# Altium project Motor_driver.PrjPcb
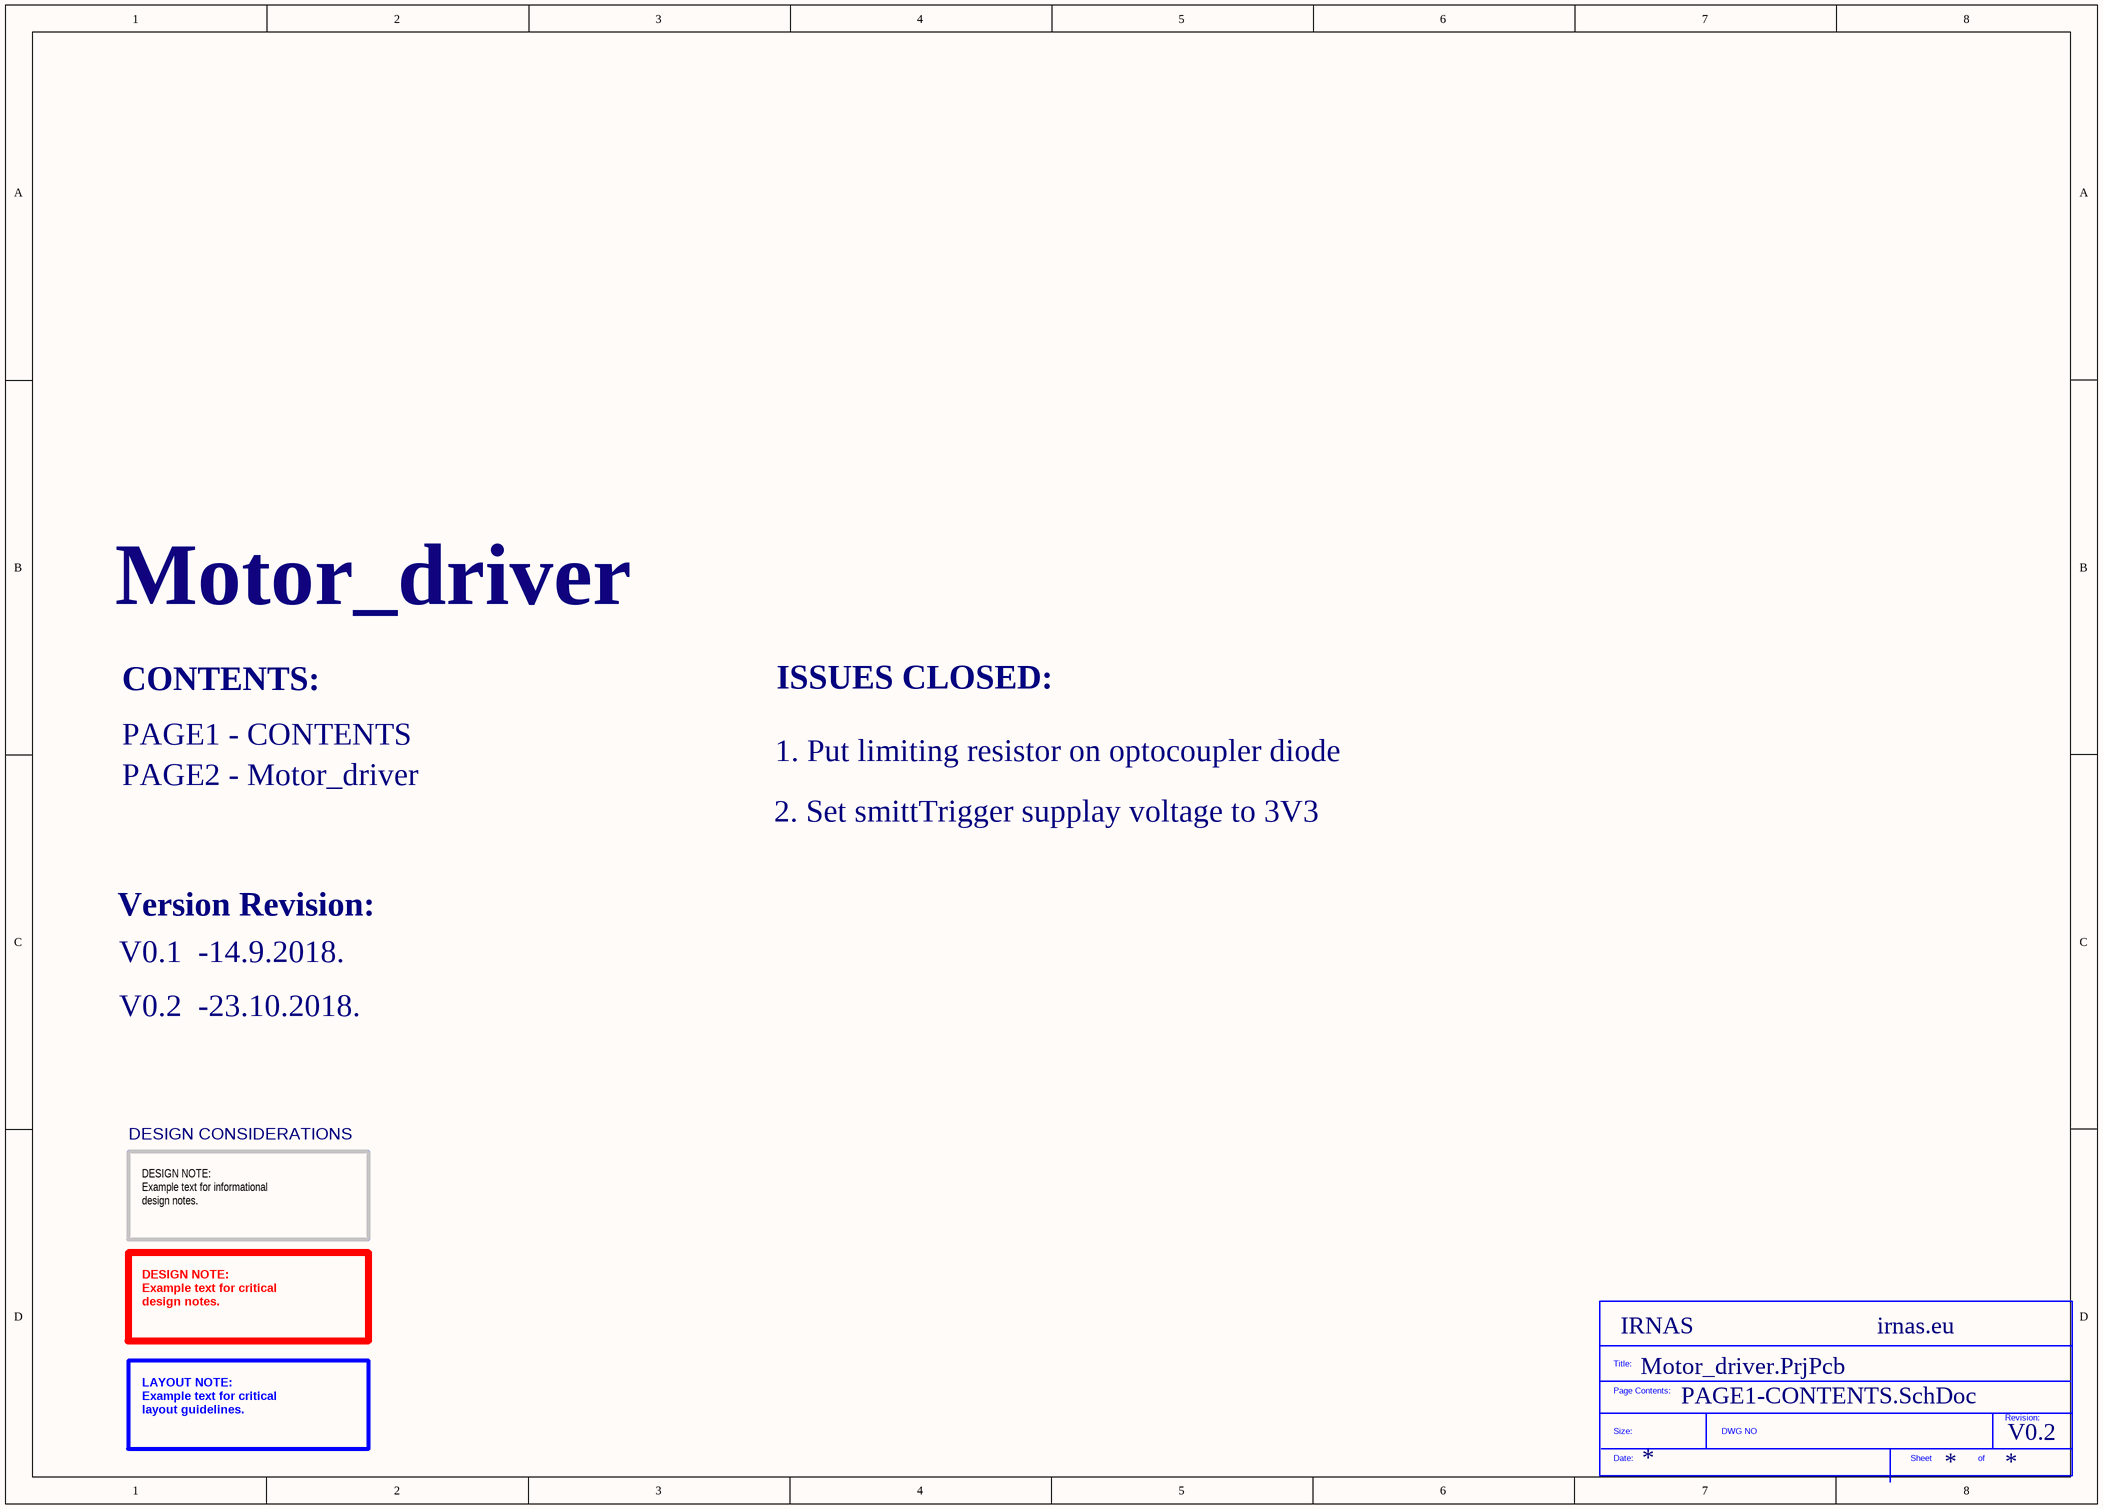
[diagram p0: PAGE1-CONTENTS.SchDoc]
Company: IRNAS; ProjectTitle: Motor_driver; Version: V0.2; website: irnas.eu
2 sheets, 36 parts. Net scope: global (net labels, ports and power ports of the same name join across sheets).
Board file: Motor_driver.PcbDoc
Sheets:
  PAGE1-CONTENTS.SchDoc
  PAGE2-Motor_driver-PCB.SchDoc

## Sheet PAGE1-CONTENTS.SchDoc
size A3

### Parts
(Parts that share a designator on the sheet are numbered #1, #2 ... from top to bottom, then left to right.)
*?#1  SDTitleBlock  (value not drawn)  (graphical)

### Notes on the sheet
- CONTENTS:
- ISSUES CLOSED:
- PAGE1 - CONTENTS
- PAGE2 - Motor_driver
- 1. Put limiting resistor on optocoupler diode
- 2. Set smittTrigger supplay voltage to 3V3
- Version Revision:
- V0.1  -14.9.2018.
- V0.2  -23.10.2018.
- DESIGN CONSIDERATIONS
- DESIGN NOTE:
  Example text for informational
  design notes.
- DESIGN NOTE:
  Example text for critical
  design notes.
- LAYOUT NOTE:
  Example text for critical
  layout guidelines.
- (in symbol SDTitleBlock) Title:; Page Contents:; Revision:; Size:; DWG NO; Date:; Sheet; of

## Sheet PAGE2-Motor_driver-PCB.SchDoc
size A3
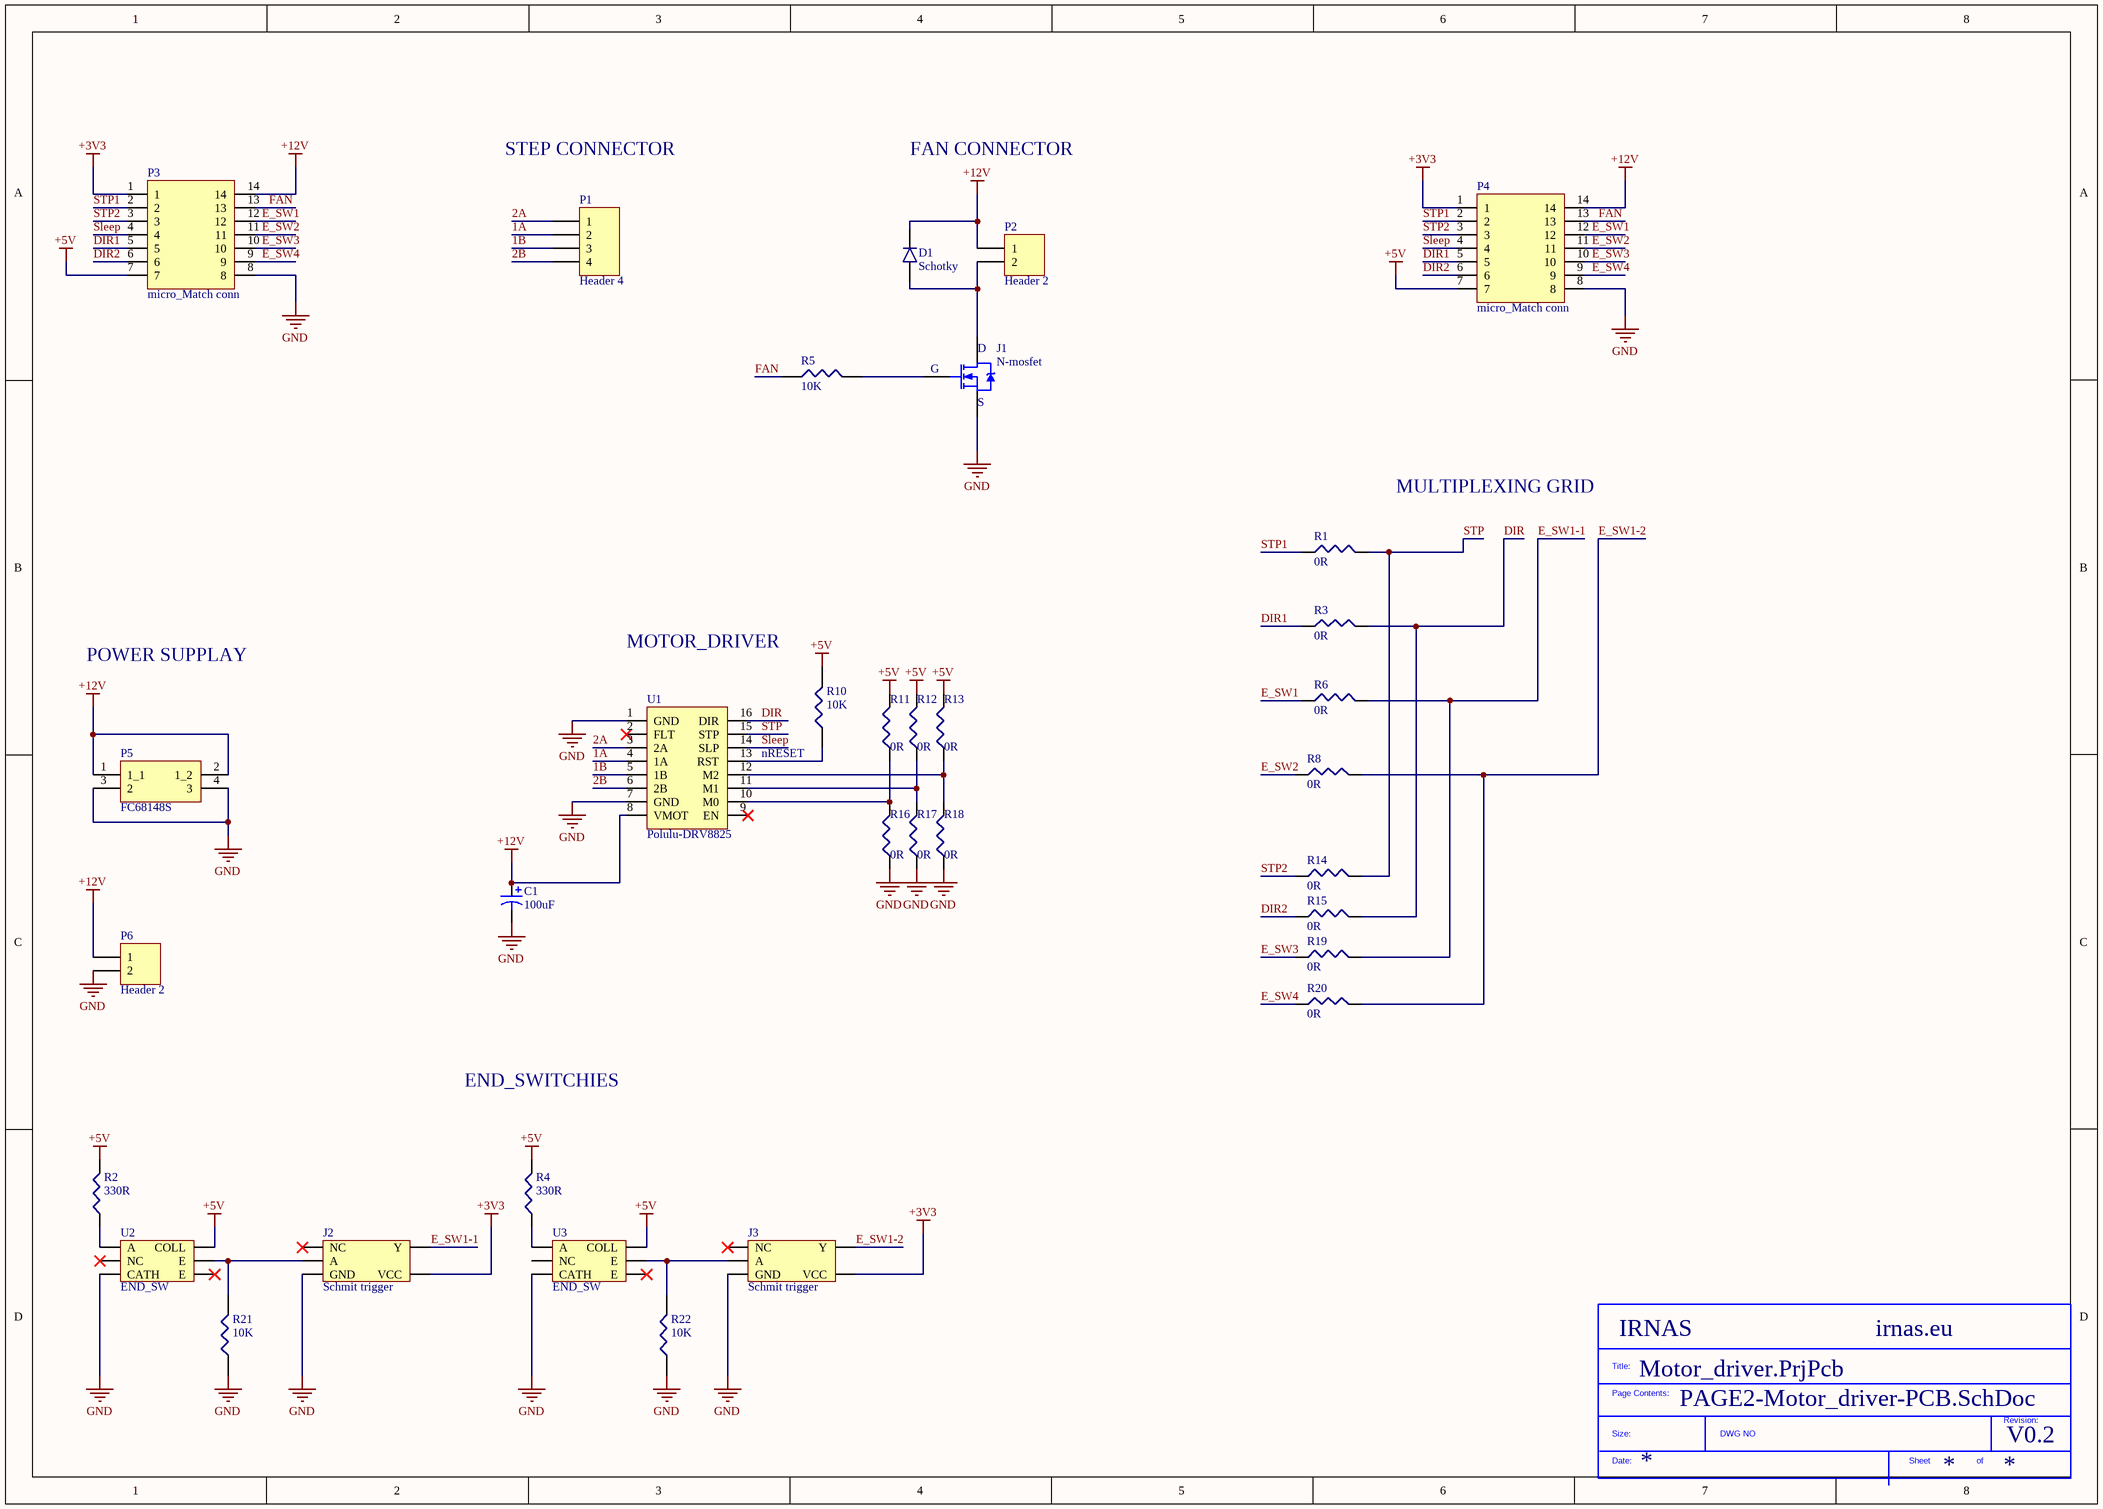
[diagram p1: PAGE2-Motor_driver-PCB.SchDoc]

### Parts
(Parts that share a designator on the sheet are numbered #1, #2 ... from top to bottom, then left to right.)
*?#2  SDTitleBlock  (value not drawn)  (graphical)
C1  100uF  [EEEFK1J470P]
D1  Schotky  [Schotky]
J1  N-mosfet  [SOT_Nmos]
J2  Schmit trigger  [SOT65P212X112-5N]
J3  Schmit trigger  [SOT65P212X112-5N]
P1  Header 4  [HDR1X4]
P2  Header 2  [HDR1X2]
P3  micro_Match conn  [micro_Match]
P4  micro_Match conn  [micro_Match]
P5  FC68148S  [DC power connector]
P6  Header 2  [HDR1X2]
R1  0R  [0603res]
R2  330R  [0603res]
R3  0R  [0603res]
R4  330R  [0603res]
R5  10K  [0603res]
R6  0R  [0603res]
R8  0R  [0603res]
R10  10K  [0603res]
R11  0R  [0603res]
R12  0R  [0603res]
R13  0R  [0603res]
R14  0R  [0603res]
R15  0R  [0603res]
R16  0R  [0603res]
R17  0R  [0603res]
R18  0R  [0603res]
R19  0R  [0603res]
R20  0R  [0603res]
R21  10K  [0603res]
R22  10K  [0603res]
U1  Polulu-DRV8825  [DIP16]
U2  END_SW  [END_switch]
U3  END_SW  [END_switch]

### Nets
+3V3: J2.5(VCC) J3.5(VCC) P3.1 P4.1
+5V: P3.7 P4.7 R2.2 R4.2 R10.2 R11.2 R12.2 R13.2 U2.6(COLL) U3.6(COLL)
+12V: C1.1 D1.2 P2.1 P3.14 P4.14 P5.1(1_1) P5.2(1_2) P6.1 U1.8(VMOT)
GND: C1.2 J1.2(S) J2.3(GND) J3.3(GND) P3.8 P4.8 P5.3(2) P5.4(3) P6.2 R16.1 R17.1 R18.1 R21.1 R22.1 U1.1(GND) U1.7(GND) U2.3(CATH) U3.3(CATH)
1A: P1.2 U1.4(1A)
1B: P1.3 U1.5(1B)
2A: P1.1 U1.3(2A)
2B: P1.4 U1.6(2B)
DIR: R3.2 R15.2 U1.16(DIR)
DIR1: P3.5 P4.5 R3.1
DIR2: P3.6 P4.6 R15.1
E_SW1: P3.12 P4.12 R6.1
E_SW1-1: J2.4(Y) R6.2 R19.2
E_SW1-2: J3.4(Y) R8.2 R20.2
E_SW2: P3.11 P4.11 R8.1
E_SW3: P3.10 P4.10 R19.1
E_SW4: P3.9 P4.9 R20.1
FAN: P3.13 P4.13 R5.1
Sleep: P3.4 P4.4 U1.14(SLP)
STP: R1.2 R14.2 U1.15(STP)
STP1: P3.2 P4.2 R1.1
STP2: P3.3 P4.3 R14.1
NetD1_1: D1.1 J1.3(D) P2.2
NetJ1_1: J1.1(G) R5.2
NetJ2_2: J2.2(A) R21.2 U2.5(E)
NetJ3_2: J3.2(A) R22.2 U3.5(E)
NetR2_1: R2.1 U2.1(A)
NetR4_1: R4.1 U3.1(A)
NetR10_1: R10.1 U1.13(RST)
NetR11_1: R11.1 R16.2 U1.10(M0)
NetR12_1: R12.1 R17.2 U1.11(M1)
NetR13_1: R13.1 R18.2 U1.12(M2)

Not connected (* = marked no-connect by the designer): J2 1(NC)*; J3 1(NC)*; U1 2(FLT)* 9(EN)*; U2 2(NC)* 4(E)*; U3 2(NC) 4(E)*

### Notes on the sheet
- STEP CONNECTOR
- FAN CONNECTOR
- MULTIPLEXING GRID
- MOTOR_DRIVER
- POWER SUPPLAY
- nRESET
- END_SWITCHIES
- (in symbol SDTitleBlock) Title:; Page Contents:; Revision:; Size:; DWG NO; Date:; Sheet; of

### Library data of the parts
C1 = 100uF: Cap Aluminum Lytic 100uF 50V 20% (8 X 10.2mm) SMD 350mA 2000h 105C Automotive T/R; Manufacturer: Panasonic; Manufacturer Part Number: EEE-FK1H101P; Type: V-Chip; Capacitance: 100 µF; Lifetime@Temperature: 2000 Hrs @ 105°C; Impedance: 0.34 Ω; Supplier 1: Farnell; Stock 1: 0; Series: FK; Rated Voltage: 50 V; Dimension: Ø 8 x 10.2 mm; Operating Temp Range: -55 to +105 °C; Ripple Current: 350 mA; Operating Temp-Max: 105 °C; Supplier Part Number 1: 9695958
D1 = NRVTS245ESFT1G: ON SEMICONDUCTOR         NRVTS245ESFT1G             Schottky Rectifier, Single, 45 V, 2 A, SOD-123, 2 Pins, 650 mV; If - Forward Current: 2 A; Vrrm - Repetitive Reverse Voltage: 45 V; Vf - Forward Voltage: 650 mV; Ifsm - Forward Surge Current: 50 A; Ir - Reverse Current: 75 uA; Supplier 1: Farnell; Manufacturer: ON Semiconductor; Manufacturer Part Number: NRVTS245ESFT1G; Stock 1: 14714; Pricing 1: 5=0.195, 25=0.14, 100=0.0844, 250=0.0724, 500=0.0605, 1000=0.0485, 5000=0.0455 (EUR); Product Category: Schottky Diodes & Rectifiers; RoHS: True; Product: Schottky Rectifiers; Mounting Style: SMD/SMT; Package / Case: SOD-123FL-2; Configuration: Single; Technology: Si; Maximum Operating Temperature: + 175 C; Minimum Operating Temperature: - 65 C; Packaging: Reel; Brand: ON Semiconductor; Factory Pack Quantity: 3000; Vr - Reverse Voltage: 45 V; Supplier Part Number 1: 2473409
J1 = IRLML6346TRPBF: INFINEON         IRLML6346TRPBF.             MOSFET Transistor, N Channel, 3.4 A, 30 V, 0.046 ohm, 4.5 V, 800 mV; FET Type: MOSFET N-Channel, Metal Oxide; FET Feature: Standard; Drain to Source Voltage (Vdss): 30V; Current - Continuous Drain (Id) @ 25°C: 3.4A (Ta); Rds On (Max) @ Id, Vgs: 63 mOhm @ 3.4A, 4.5V; Vgs(th) (Max) @ Id: 1.1V @ 10µA; Gate Charge (Qg) @ Vgs: 2.9nC @ 4.5V; Input Capacitance (Ciss) @ Vds: 270pF @ 24V; Power - Max: 1.3W; Supplier 1: Farnell; Manufacturer: Infineon; Manufacturer Part Number: IRLML6346TRPBF; Stock 1: 11546; Pricing 1: 5=0.242, 25=0.176, 100=0.11, 250=0.0975, 500=0.0849, 1000=0.0724, 5000=0.0617 (EUR); Category: Discrete Semiconductor Products; Family: Transistors - FETs, MOSFETs - Single; Series: HEXFET®; Packaging: Tape & Reel (TR); Part Status: Active; Operating Temperature: -55°C ~ 150°C (TJ); Mounting Type: Surface Mount; Package / Case: TO-236-3, SC-59, SOT-23-3; Supplier Device Package: Micro3™/SOT-23; Supplier Part Number 1: 1857300
J2 J3 = 74AHC1G14GW@125: Manufacturer: NXP Semiconductors; Supplier 1: Farnell; Manufacturer Part Number: 74AHC1G14GW@125; Stock 1: 10993; Pricing 1: 5=0.153, 50=0.108, 100=0.062, 250=0.059, 500=0.043 (EUR); Supplier Part Number 1: 1085241
P1 = Header 4: Header, 4-Pin; LatestRevisionDate: 17-Jul-2002; LatestRevisionNote: Re-released for DXP Platform.; Publisher: Altium Limited
P2 P6 = Header 2: Header, 2-Pin; LatestRevisionDate: 17-Jul-2002; LatestRevisionNote: Re-released for DXP Platform.; Publisher: Altium Limited
P3 P4 = micro_Match: AMP FROM TE CONNECTIVITY         1-2178711-4             Wire-To-Board Connector, Micro-MaTch Value-Line Series, 14 Contacts, Receptacle, 1.27 mm; Manufacturer: TE Connectivity AMP; Number of Contacts: 14; Pitch: 1.27mm; Body Orientation: Straight; Supplier 1: Farnell; Manufacturer Part Number: 1-2178711-4; Stock 1: 904; Pricing 1: 1=1.24, 25=1.15, 70=1.06, 200=0.977, 450=0.89 (EUR); Number of Rows: 2; Type: Board to Board; Mounting Type: Surface Mount; Termination Method: Solder; Series: Micro-MaTch; Contact Material: Copper Alloy; Supplier Part Number 1: 2473362
P5 = DC 2.1mm power connector: DC 2.1mm connector; Manufacturer: Cliff; Gender: Jack; Current Rating: 2A; Connector Mounting: Surface Mount; Barrel Outer Diameter: 6.4mm; Voltage Rating: 12V; SVHC: No SVHC (17-Dec-2015); Supplier 1: Farnell; Manufacturer Part Number: FC68148S; Stock 1: 0; Pin Diameter: 2.1mm; Barrel Length: -; Contact Termination Type: Surface Mount; Barrel Inner Diameter: -; Product Range: -; ComponentLink1URL: http://www.farnell.com/datasheets/1864271.pdf; ComponentLink1Description: http://www.farnell.com/datasheets/1864271.pdf; Supplier Part Number 1: 1889309
R1 R3 R6 R8 R11-R20 = 0R: RES SMD 0.0OHM JUMPER 1/20W 0201; Manufacturer: Vishay; Manufacturer Part Number: CRCW02010000Z0ED; Brand: Vishay / Dale; Resistance: 0 Ohms; Unit Weight: 0.000006 oz; Supplier 1: Farnell; Stock 1: 0; Product Category: Thick Film Resistors - SMD; RoHS: Details; Case Code - in: 0201; Case Code - mm: 0603; Operating Temperature Range: - 55 C to + 155 C; Series: CRCW; Height: 0.23 mm; Length: 0.6 mm; Package / Case: 0201 (0603 metric); Packaging: Reel; Product: Thick Film Resistors Zero-Ohm; Factory Pack Quantity: 10000; Termination Style: SMD/SMT; Width: 0.3 mm; ComponentLink1URL: https://datasheet.ciiva.com/2471/crcw0201e3-2471712.pdf; ComponentLink1Description: https://datasheet.ciiva.com/2471/crcw0201e3-2471712.pdf; ComponentLink2URL: https://datasheet.ciiva.com/2471/crcw0201e3-2471713.pdf; ComponentLink2Description: https://datasheet.ciiva.com/2471/crcw0201e3-2471713.pdf; ComponentLink3URL: https://datasheet.ciiva.com/7841/1719906-7841430.pdf; ComponentLink3Description: https://datasheet.ciiva.com/7841/1719906-7841430.pdf; ComponentLink4URL: https://datasheet.ciiva.com/7841/1719906-7841431.pdf; ComponentLink4Description: https://datasheet.ciiva.com/7841/1719906-7841431.pdf; ComponentLink5URL: https://datasheet.ciiva.com/22665/1847332-22665688.pdf; ComponentLink5Description: https://datasheet.ciiva.com/22665/1847332-22665688.pdf; ComponentLink6URL: https://datasheet.ciiva.com/16757/70202042-16757849.pdf; ComponentLink6Description: https://datasheet.ciiva.com/16757/70202042-16757849.pdf; ComponentLink7URL: https://datasheet.ciiva.com/16436/crcw0201e3-16436237.pdf; ComponentLink7Description: https://datasheet.ciiva.com/16436/crcw0201e3-16436237.pdf; ComponentLink8URL: https://datasheet.ciiva.com/2471/crcw0201e3-2471711.pdf; ComponentLink8Description: https://datasheet.ciiva.com/2471/crcw0201e3-2471711.pdf; Supplier Part Number 1: 2139811
R2 R4 = 330R: RES SMD 330 OHM 0.1% 1/10W 0603; Manufacturer: Panasonic Electronic Components; Manufacturer Part Number: ERA-3AEB331V; Power (Watts): 0.1W, 1/10W; Temperature Coefficient: ±25ppm/°C; Supplier 1: Digi-Key; RoHS: RoHS Compliant; Category: Resistors; Stock 1: 125000; Pricing 1: 5000=0.03717, 10000=0.03469, 25000=0.03422 (USD); Packaging: Tape & Reel (TR); Part Status: Active; Tolerance: ±0.1%; Composition: Thin Film; Features: Automotive AEC-Q200; Operating Temperature: -55°C ~ 155°C; Package / Case: 0603 (1608 Metric); Supplier Device Package: 0603; Size / Dimension: 0.063" L x 0.032" W (1.60mm x 0.80mm); Height - Seated (Max): 0.022" (0.55mm); Failure Rate: -; ComponentLink1URL: https://industrial.panasonic.com/cdbs/www-data/pdf/RDM0000/AOA0000C307.pdf; ComponentLink1Description: https://industrial.panasonic.com/cdbs/www-data/pdf/RDM0000/AOA0000C307.pdf; Supplier Part Number 1: P330DBTR-ND
R5 R10 R21 R22 = 10K: RES SMD 10K OHM 1% 1/20W 0201; Manufacturer: Vishay; Manufacturer Part Number: CRCW020110K0FNED; Brand: Vishay / Dale; Resistance: 10 kOhms; Power Rating: 50 mW; Temperature Coefficient: 200 PPM / K; Voltage Rating: 30 V; Unit Weight: 0.000006 oz; Supplier 1: Farnell; Stock 1: 2600; Pricing 1: 10=0.0338, 100=0.0237, 500=0.0124, 2500=0.0092, 5000=0.0076 (EUR); Product Category: Thick Film Resistors; RoHS: True; Tolerance: 1 %; Case Code - in: 0201; Case Code - mm: 0603; Operating Temperature Range: - 55 C to + 155 C; Series: CRCW; Height: 0.23 mm; Length: 0.6 mm; Package / Case: 0201 (0603 metric); Packaging: Reel; Product: Thick Film Resistors SMD; Termination Style: SMD/SMT; Width: 0.3 mm; ComponentLink1URL: https://datasheet.ciiva.com/2474/crcw0201e3-2474818.pdf; ComponentLink1Description: https://datasheet.ciiva.com/2474/crcw0201e3-2474818.pdf; ComponentLink2URL: https://datasheet.ciiva.com/2474/crcw0201e3-2474819.pdf; ComponentLink2Description: https://datasheet.ciiva.com/2474/crcw0201e3-2474819.pdf; ComponentLink3URL: https://datasheet.ciiva.com/2474/crcw0201e3-2474820.pdf; ComponentLink3Description: https://datasheet.ciiva.com/2474/crcw0201e3-2474820.pdf; ComponentLink4URL: https://datasheet.ciiva.com/22692/1719906-22692709.pdf; ComponentLink4Description: https://datasheet.ciiva.com/22692/1719906-22692709.pdf; ComponentLink5URL: https://datasheet.ciiva.com/7983/1719906-7983319.pdf; ComponentLink5Description: https://datasheet.ciiva.com/7983/1719906-7983319.pdf; ComponentLink6URL: https://datasheet.ciiva.com/22868/70202042-22868839.pdf; ComponentLink6Description: https://datasheet.ciiva.com/22868/70202042-22868839.pdf; ComponentLink7URL: https://datasheet.ciiva.com/7983/1719906-7983320.pdf; ComponentLink7Description: https://datasheet.ciiva.com/7983/1719906-7983320.pdf; ComponentLink8URL: https://datasheet.ciiva.com/16436/dcrcwe3-16436222.pdf; ComponentLink8Description: https://datasheet.ciiva.com/16436/dcrcwe3-16436222.pdf; Supplier Part Number 1: 2140192
U1 = DRV8825
U2 U3 = TCUT1300X01: SENSOR OPTO SLOT 3MM TRANS SMD; Manufacturer: Vishay Semiconductors; Collector Current (DC): 0.02 A; Collector-Emitter Voltage: 20 V; DELETED: Compliant; Fall Time: 150000 ns; Forward Current: 25 mA; Number of  Elements: 2; Output Device: Phototransistor; Power Dissipation: 0.075 W; Rad Hardened: No; Reverse Breakdown Voltage: 5 V; Slit Width: 0.3 mm; Supplier 1: Farnell; Manufacturer Part Number: TCUT1300X01; Stock 1: 2041; Pricing 1: 1=1.17, 50=1.02, 100=0.884, 500=0.744, 1000=0.571 (EUR); Collector Current (DC) (Max): 0.02 A; Gap Width: 3 mm; Mounting: Surface Mount; Operating Temp Range: -40C to 85C; Operating Temperature Classification: Industrial; Package Type: SMD; Packaging: Tape and Reel; Pin Count: 6; Rise Time: 150000 ns; Type: Transmissive; ComponentLink1URL: https://datasheet.ciiva.com/6858/tcut1300-6858353.pdf; ComponentLink1Description: https://datasheet.ciiva.com/6858/tcut1300-6858353.pdf; ComponentLink2URL: https://datasheet.ciiva.com/4423/tcut1300-96295-4423538.pdf; ComponentLink2Description: https://datasheet.ciiva.com/4423/tcut1300-96295-4423538.pdf; ComponentLink3URL: https://datasheet.ciiva.com/11772/0900766b80ed1f8e-11772595.pdf; ComponentLink3Description: https://datasheet.ciiva.com/11772/0900766b80ed1f8e-11772595.pdf; ComponentLink4URL: https://datasheet.ciiva.com/15117/getdatasheetpartid-248339-15117059.pdf; ComponentLink4Description: https://datasheet.ciiva.com/15117/getdatasheetpartid-248339-15117059.pdf; ComponentLink5URL: https://datasheet.ciiva.com/2823/tcut1300-2823075.pdf; ComponentLink5Description: https://datasheet.ciiva.com/2823/tcut1300-2823075.pdf; ComponentLink6URL: https://datasheet.ciiva.com/2823/tcut1300-2823076.pdf; ComponentLink6Description: https://datasheet.ciiva.com/2823/tcut1300-2823076.pdf; ComponentLink7URL: https://datasheet.ciiva.com/2823/tcut1300-2823077.pdf; ComponentLink7Description: https://datasheet.ciiva.com/2823/tcut1300-2823077.pdf; ComponentLink8URL: https://datasheet.ciiva.com/16493/tcut1300-16493702.pdf; ComponentLink8Description: https://datasheet.ciiva.com/16493/tcut1300-16493702.pdf; ComponentLink9URL: https://datasheet.ciiva.com/26184/tcut1300-26184396.pdf; ComponentLink9Description: https://datasheet.ciiva.com/26184/tcut1300-26184396.pdf; ComponentLink10URL: https://datasheet.ciiva.com/7657/tcut1300-7657886.pdf; ComponentLink10Description: https://datasheet.ciiva.com/7657/tcut1300-7657886.pdf; Supplier Part Number 1: 2251270